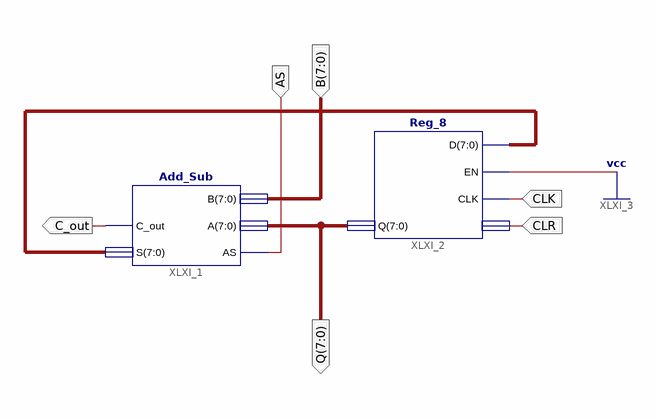
[diagram p0: schematic sheet 1]
// Xilinx ISE schematic Tally_Circuit.sch (spartan3e) as structural Verilog: 2 symbols, 6 ports
module Tally_Circuit (
  input  CLR,
  input  CLK,
  input  [7:0] B,
  input  AS,
  output [7:0] Q,
  output C_out
);

  wire [7:0] XLXN_6;

  Add_Sub XLXI_1 (.A(Q), .AS(AS), .B(B), .C_out(C_out), .S(XLXN_6));
  Reg_8 XLXI_2 (.CLK(CLK), .D(XLXN_6), .EN(1'b1), .Q(Q));  // open: CLEAR
endmodule
